# EAGLE design board (EAGLE 9.6.2)
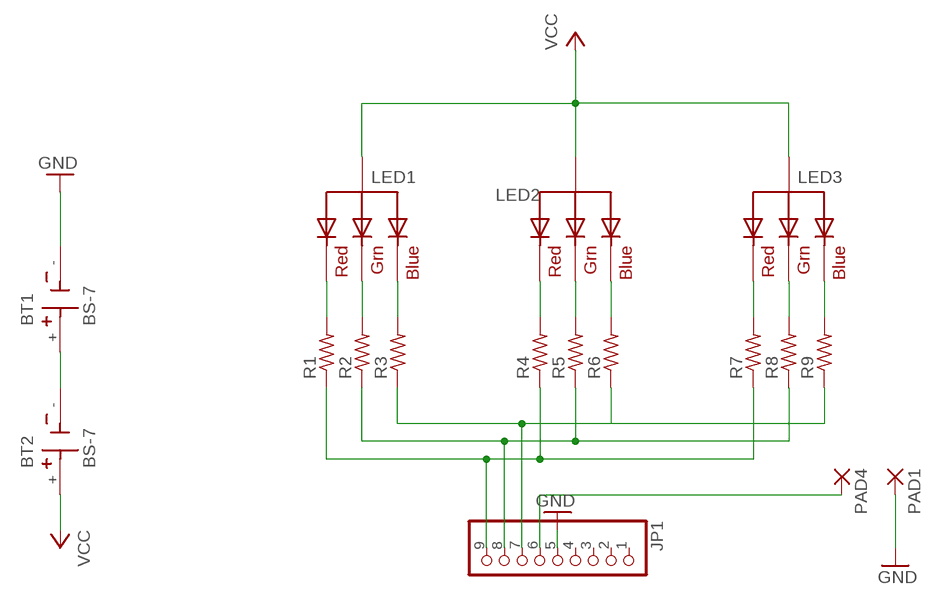
[diagram p0: schematic, sheet 1]

## Parts
BT1  BS-7  [BAT_BS-7]
BT2  BS-7  [BAT_BS-7]
JP1  PINHD-1X9  [1X09-BIG]
LED1  RGBLED_CA-5MM  [LED5MMRGB]
LED2  RGBLED_CA-5MM  [LED5MMRGB]
LED3  RGBLED_CA-5MM  [LED5MMRGB]
PAD1  1,6/0,8  [1,6/0,8]
PAD4  1,6/0,8  [1,6/0,8]
R1  R-US_0207/7  [0207/7]
R2  R-US_0207/7  [0207/7]
R3  R-US_0207/7  [0207/7]
R4  R-US_0207/7  [0207/7]
R5  R-US_0207/7  [0207/7]
R6  R-US_0207/7  [0207/7]
R7  R-US_0207/7  [0207/7]
R8  R-US_0207/7  [0207/7]
R9  R-US_0207/7  [0207/7]

## Nets
GND: BT1.- JP1.5 PAD1.1(P)
N$1: BT1.+ BT2.-
N$2: LED3.1(RED) R7.2
N$3: LED3.3(GREEN) R8.2
N$4: LED1.1(RED) R1.2
N$5: LED1.3(GREEN) R2.2
N$6: LED1.4(BLUE) R3.2
N$7: LED2.1(RED) R4.2
N$8: LED2.3(GREEN) R5.2
N$9: LED2.4(BLUE) R6.2
N$10: LED3.4(BLUE) R9.2
N$11: JP1.9 R1.1 R4.1 R7.1
N$12: JP1.6 PAD4.1(P)
N$13: JP1.8 R2.1 R5.1 R8.1
N$15: JP1.7 R3.1 R6.1 R9.1
VCC: BT2.+ LED1.2(VCC) LED2.2(VCC) LED3.2(VCC)
Unconnected: JP1.1 JP1.2 JP1.3 JP1.4

## Library data of the parts
BT1 BT2 = BS-7:BS-7: BATTERY HOLDER COIN 20MM PC PIN Check availability <https://pricing.snapeda.com/parts/BS-7/MPD%20%28Memory/view-part?ref=eda>; AVAILABILITY: In Stock; DESCRIPTION: Battery Holder (Open) Coin, 20.0mm 1 Cell PC Pin; MF: MPD (Memory; MP: BS-7; PACKAGE: None; PRICE: None; PURCHASE-URL: https://pricing.snapeda.com/search/part/BS-7/?ref=eda
JP1 = adafruit:PINHD-1X9: Pin header 1x10 0.1" spacing With round pins
LED1-LED3 = adafruit:RGBLED_CA: RGB LED, common-anode 5MM Staggered pins 5mm Piranha package http://www.ladyada.net/library/pcb/eaglelibrary.html
PAD1 PAD4 = wirepad:1,6/0,8: THROUGH-HOLE PAD
R1-R9 = rcl:R-US_: RESISTOR, American symbol; SPICEPREFIX: R

## Board
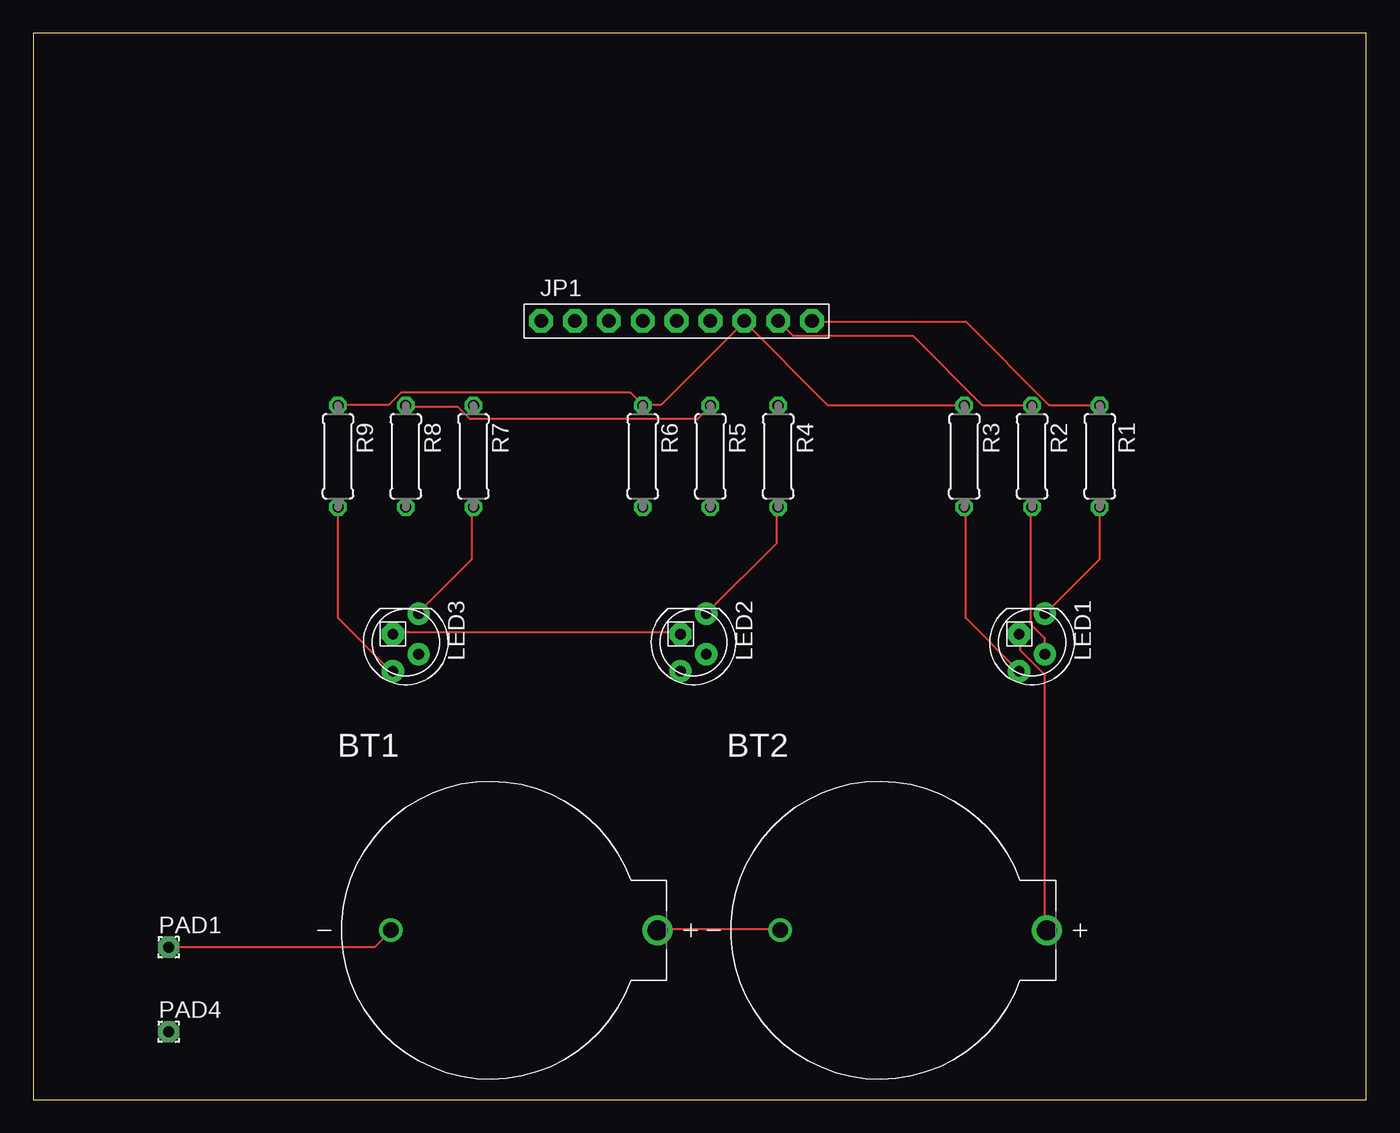
[diagram p1: board, top side]
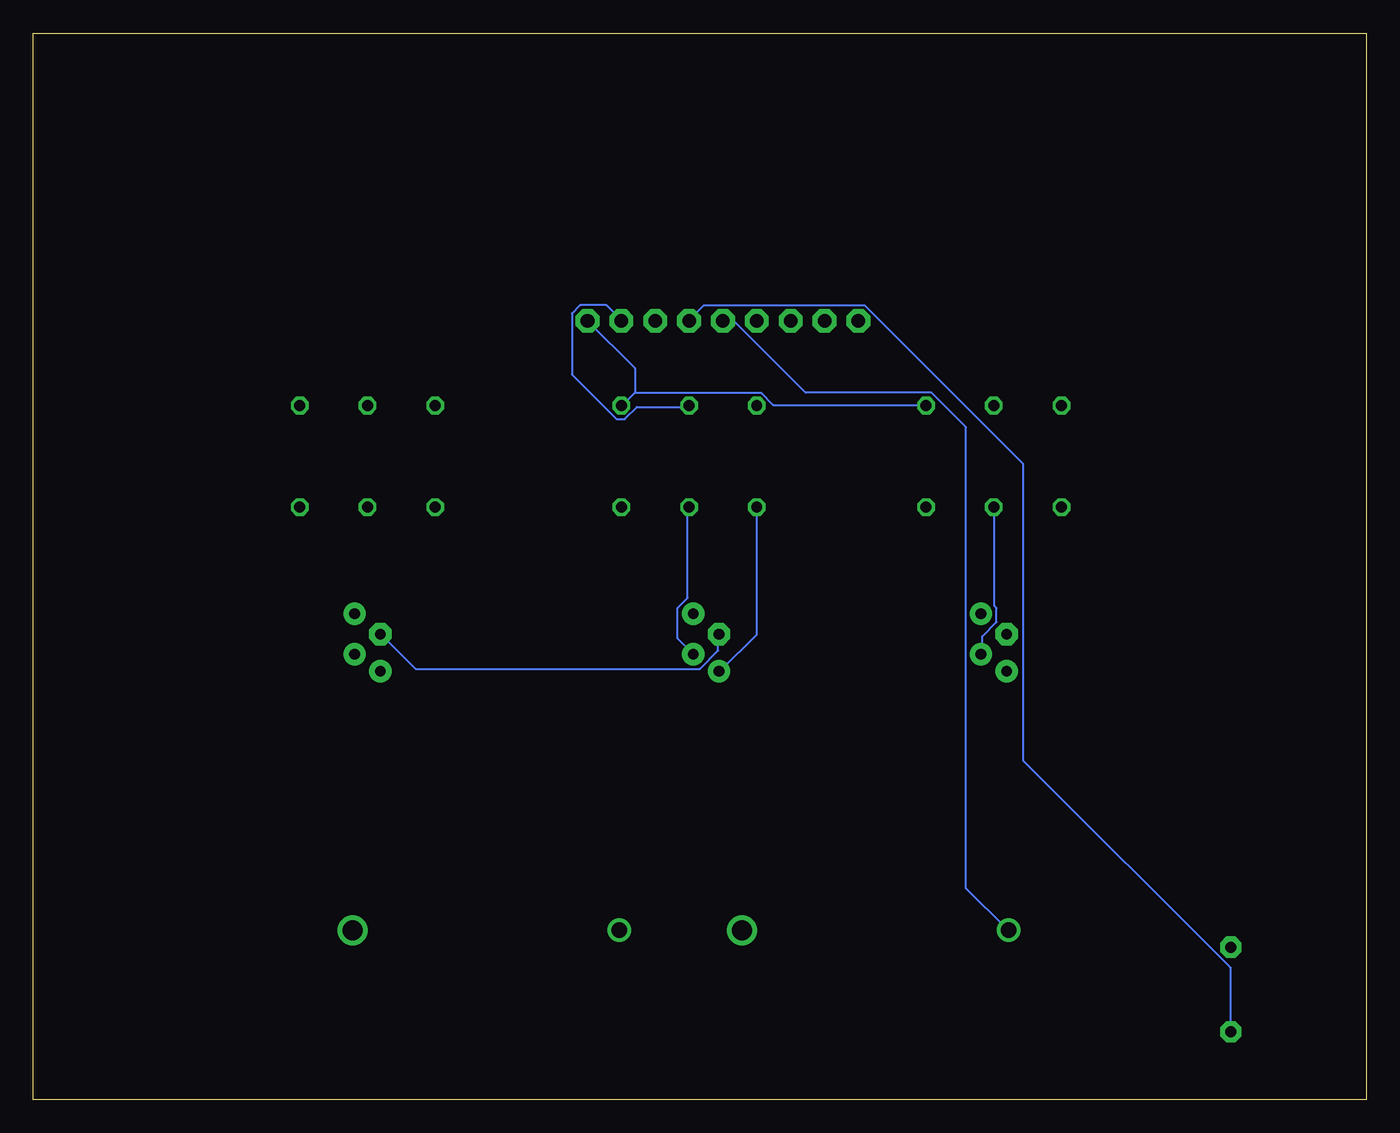
[diagram p2: board, bottom side, seen from below]

Size 100 x 80 mm. Coordinates in mm from the lower left corner, seen from the top.
Outline: 0,0 100,0 100,80 0,80 0,0
Copper layers (1*16): Top 0.035mm / dielectric 1.5mm / Bottom 0.035mm
Design rules "default": minimum track width 6mil, minimum drill 0.35mm, track to track 6mil, track to pad 6mil, pad to pad 6mil, via to via 6mil, smd to smd 6mil, copper to edge 40mil, drill to drill 6mil, minimum pad ring 10mil, minimum via ring 8mil, stop-mask expansion 4mil, vias tented up to drill 0mil, thermal gap 10mil

### Footprints (pad centres in the part's own frame; a part is rotated, then mirrored left to right if it is on the bottom)
BAT_BS-7 = drill 1.5: + 10,0 | drill 1.17: - -10,0
1X09-BIG = drill 1.016 pad 1.778 octagon: 1 -10.16,0; 2 -7.62,0; 3 -5.08,0; 4 -2.54,0; 5 0,0; 6 2.54,0; 7 5.08,0; 8 7.62,0; 9 10.16,0
LED5MMRGB = drill 0.8 pad 1.676: 1 -2.159,0.968; 3 0.889,0.968; 4 2.159,-0.968 | drill 0.8 pad 1.676 octagon: 2 -0.635,-0.968
1,6/0,8 = drill 0.813 pad 1.6 octagon: 1 0,0
0207/7 = drill 0.813 octagon: 1 -3.81,0; 2 3.81,0

### Placement (x,y rotation side)
BT1  36.83,12.7 0 top
BT2  66.04,12.7 0 top
JP1  48.26,58.42 0 top
LED1  74.93,34.29 270 top
LED2  49.53,34.29 270 top
LED3  27.94,34.29 270 top
PAD1  10.16,11.43 0 top
PAD4  10.16,5.08 0 top
R1  80.01,48.26 270 top
R2  74.93,48.26 270 top
R3  69.85,48.26 270 top
R4  55.88,48.26 270 top
R5  50.8,48.26 270 top
R6  45.72,48.26 270 top
R7  33.02,48.26 270 top
R8  27.94,48.26 270 top
R9  22.86,48.26 270 top

### Tracks (layer width: path | path; a pad name or v marks a point on that pad's centre or on a via)
GND
  Top 0.152: PAD1.1 25.6,11.43 26.82,12.65 BT1.-
  Bottom 0.152: JP1.5 48.16,58.37 47.4,58.37 42.06,53.03 32.61,53.03 30.02,50.44 30.02,15.85 26.98,12.8 BT1.-
N$1
  Top 0.152: BT2.- 55.93,12.8 46.94,12.8 BT1.+
N$2
  Top 0.152: R7.2 32.92,44.35 32.92,40.54 28.96,36.58 LED3.1
N$3
  Bottom 0.152: R8.2 27.89,44.35 27.89,37.03 27.74,36.88 27.74,35.81 28.8,34.75 28.8,33.53 LED3.3
N$4
  Top 0.152: R1.2 80.01,40.54 76.05,36.58 LED1.1
N$5
  Top 0.152: R2.2 74.83,44.35 74.83,35.66 75.89,34.59 75.89,33.53 LED1.3
N$6
  Top 0.152: R3.2 69.95,44.35 69.95,36.12 73.91,32.16 LED1.4
N$7
  Top 0.152: R4.2 55.78,44.35 55.78,41.76 50.6,36.58 LED2.1
N$8
  Bottom 0.152: R5.2 50.9,44.35 50.9,37.64 51.66,36.88 51.66,34.59 50.6,33.53 LED2.3
N$9
  Bottom 0.152: R6.2 45.72,34.9 48.46,32.16 LED2.4
N$10
  Top 0.152: R9.2 22.86,36.12 26.82,32.16 LED3.4
N$11
  Top 0.152: R1.1 80.01,52.12 76.2,52.12 69.95,58.37 58.52,58.37 JP1.9
  Bottom 0.152: 54.86,53.03 45.41,53.03 44.5,52.12 33.07,52.12 R7.1 | 54.86,53.03 55.78,52.12 R4.1 | 54.86,53.03 54.86,54.86 JP1.9
N$12
  Bottom 0.152: PAD4.1 10.21,5.18 10.21,9.91 25.76,25.45 25.76,47.7 37.64,59.59 49.68,59.59 50.75,58.52 JP1.6
N$13
  Top 0.152: R8.1 28.04,51.97 31.85,51.97 32.77,51.05 49.84,51.05 50.75,51.97 R5.1 | JP1.8 57,57.3 65.99,57.3 71.17,52.12 74.83,52.12 R2.1
  Bottom 0.152: R5.1 50.9,51.97 54.71,51.97 55.63,51.05 56.24,51.05 59.59,54.41 59.59,58.98 58.98,59.59 57,59.59 55.93,58.52 JP1.8
N$15
  Top 0.152: 45.72,52.12 44.81,53.03 27.58,53.03 26.67,52.12 22.86,52.12 R9.1 | 53.34,58.37 59.59,52.12 69.8,52.12 R3.1 | 45.72,52.12 47.09,52.12 53.34,58.37 | 45.72,52.12 R6.1 | 53.34,58.37 JP1.7
VCC
  Top 0.152: LED3.2 26.98,35.05 48.46,35.05 LED2.2 | LED1.2 74.07,34.9 74.07,33.68 75.89,31.85 75.89,12.8 BT2.+
  Bottom 0.152: LED2.2 48.62,34.9 48.62,33.68 49.99,32.31 71.32,32.31 73.91,34.9 LED1.2